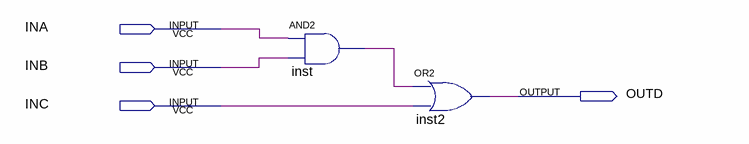
[diagram p0: schematic sheet]
// Quartus schematic CKTO_3.bdf as structural Verilog: 2 symbols, 4 pins
module CKTO_3 (
  input  INA,
  input  INB,
  input  INC,
  output OUTD
);

  wire inst_out;

  and inst (inst_out, INA, INB);
  or inst2 (OUTD, inst_out, INC);
endmodule
